# EAGLE schematic mainSch (EAGLE 8.2.2)
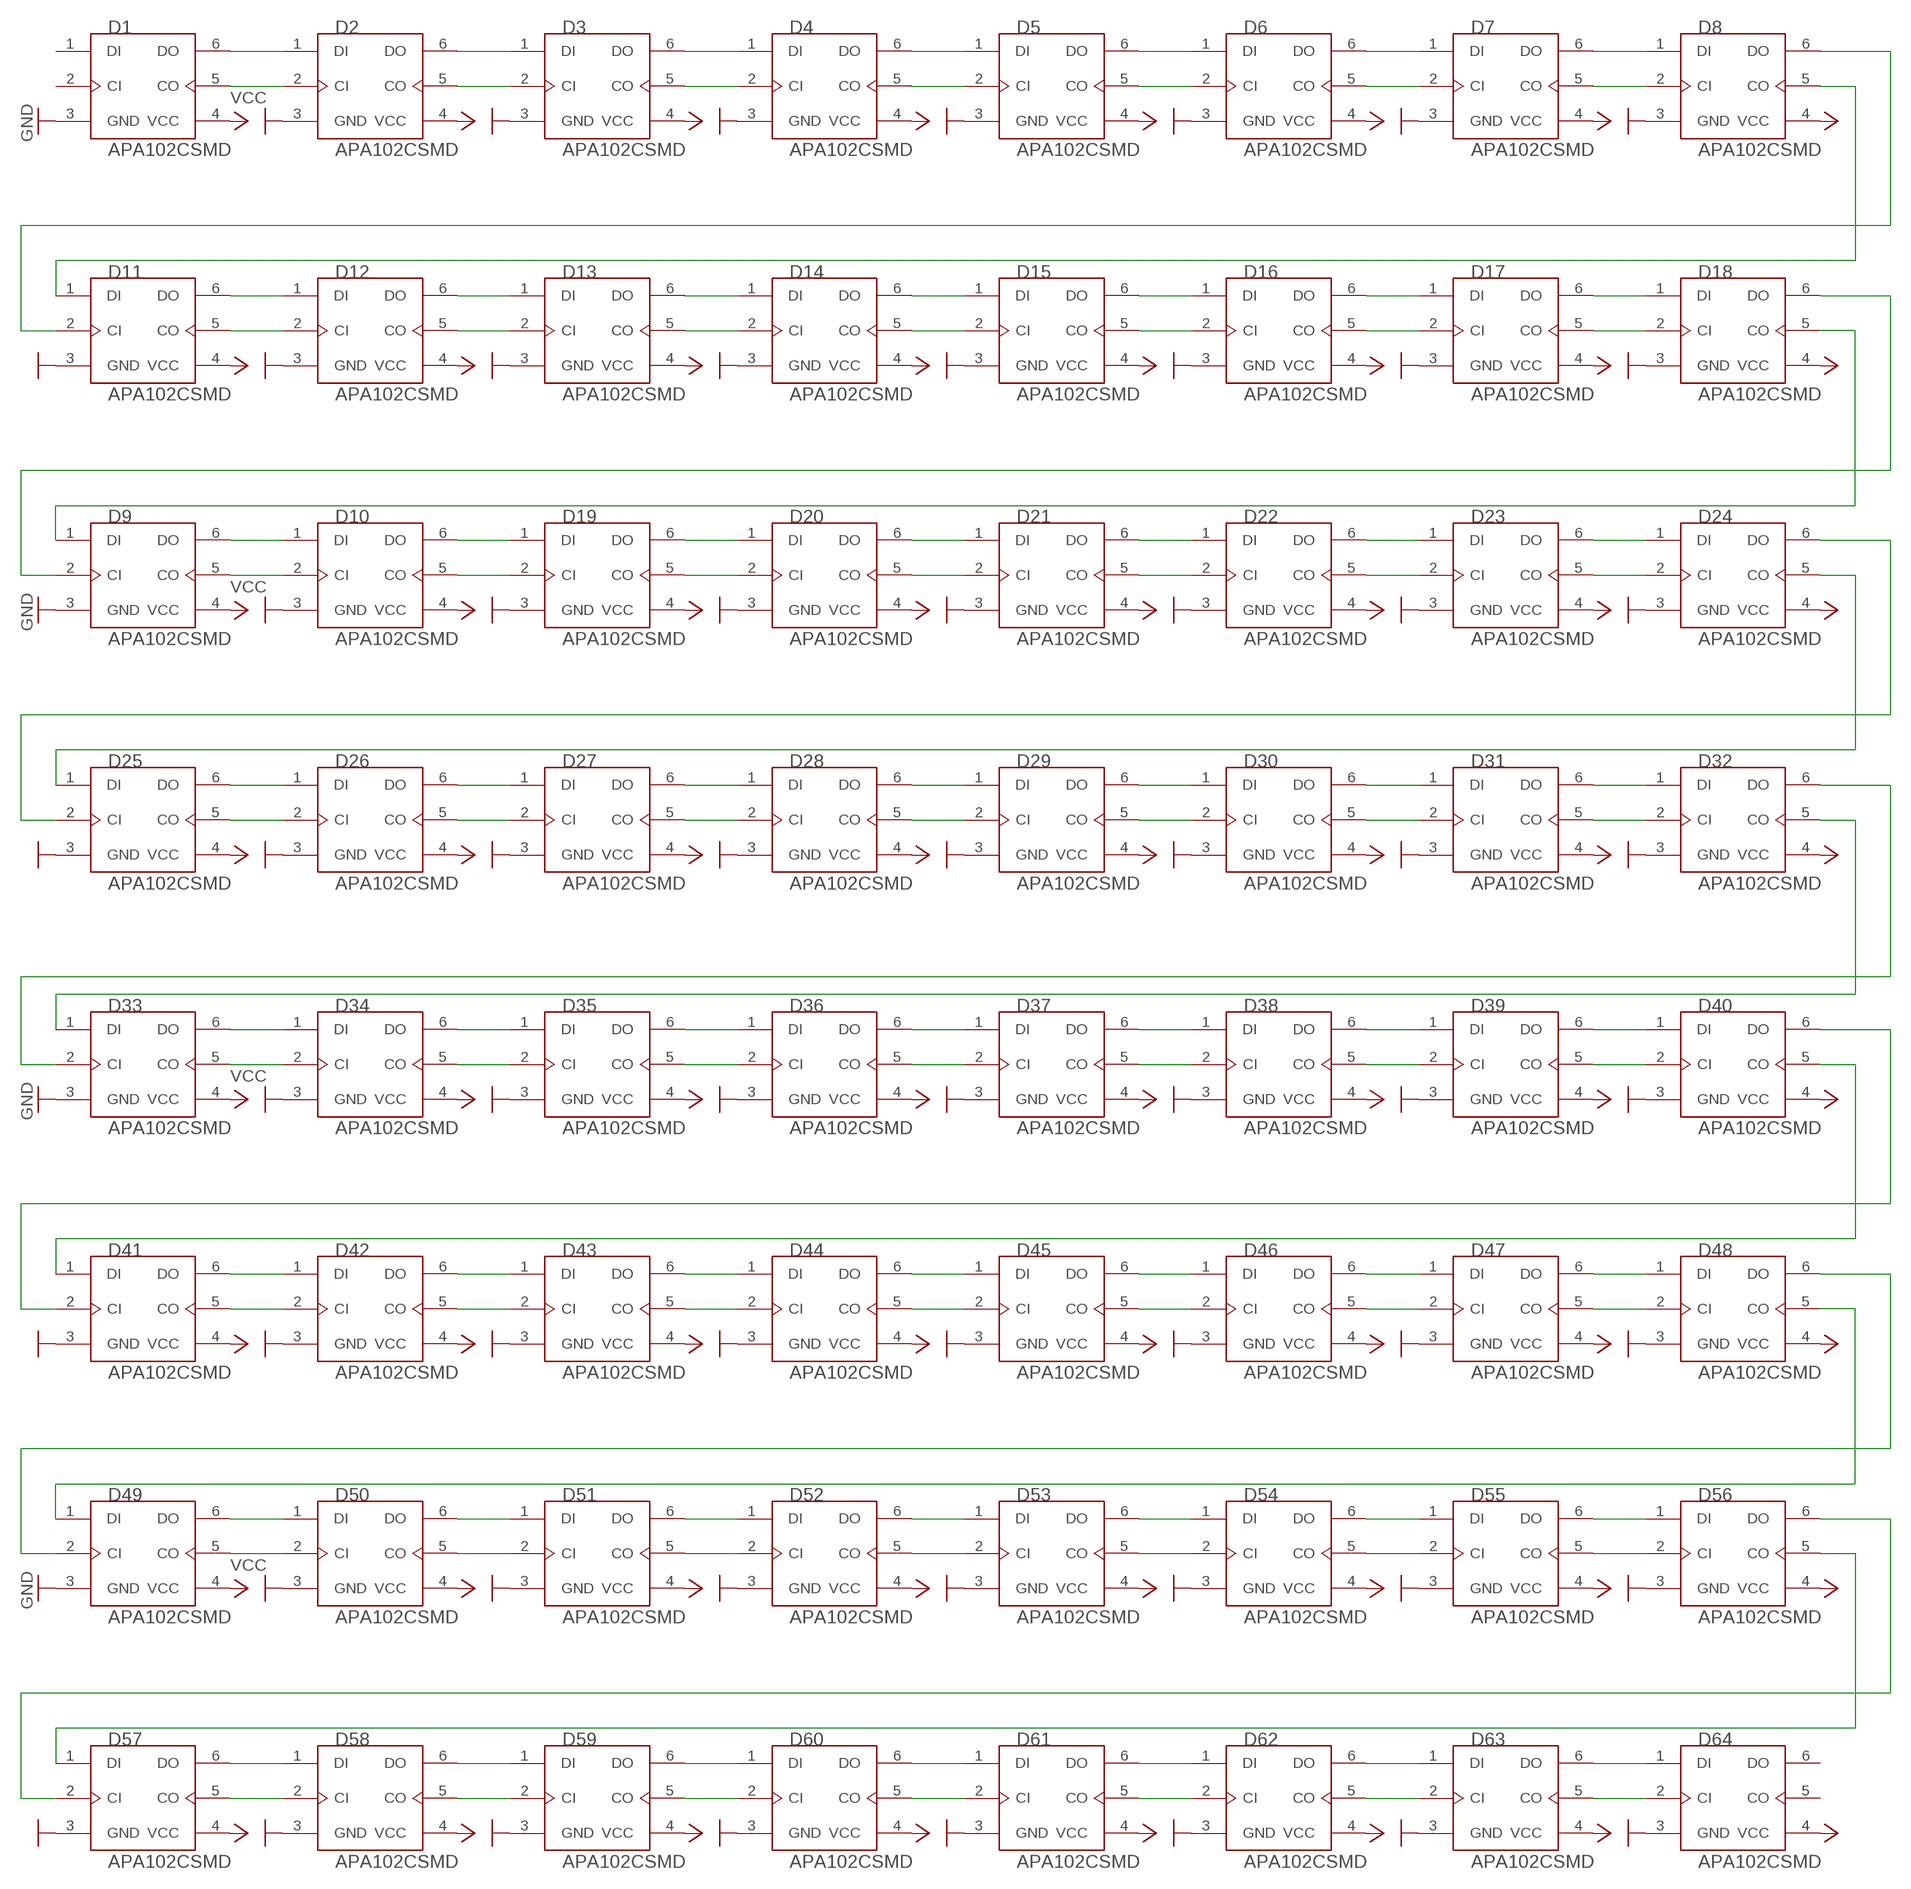
[diagram p0: schematic, sheet 1]

## Parts
D1  APA102CSMD  [APA102C-5050-SMD]
D2  APA102CSMD  [APA102C-5050-SMD]
D3  APA102CSMD  [APA102C-5050-SMD]
D4  APA102CSMD  [APA102C-5050-SMD]
D5  APA102CSMD  [APA102C-5050-SMD]
D6  APA102CSMD  [APA102C-5050-SMD]
D7  APA102CSMD  [APA102C-5050-SMD]
D8  APA102CSMD  [APA102C-5050-SMD]
D9  APA102CSMD  [APA102C-5050-SMD]
D10  APA102CSMD  [APA102C-5050-SMD]
D11  APA102CSMD  [APA102C-5050-SMD]
D12  APA102CSMD  [APA102C-5050-SMD]
D13  APA102CSMD  [APA102C-5050-SMD]
D14  APA102CSMD  [APA102C-5050-SMD]
D15  APA102CSMD  [APA102C-5050-SMD]
D16  APA102CSMD  [APA102C-5050-SMD]
D17  APA102CSMD  [APA102C-5050-SMD]
D18  APA102CSMD  [APA102C-5050-SMD]
D19  APA102CSMD  [APA102C-5050-SMD]
D20  APA102CSMD  [APA102C-5050-SMD]
D21  APA102CSMD  [APA102C-5050-SMD]
D22  APA102CSMD  [APA102C-5050-SMD]
D23  APA102CSMD  [APA102C-5050-SMD]
D24  APA102CSMD  [APA102C-5050-SMD]
D25  APA102CSMD  [APA102C-5050-SMD]
D26  APA102CSMD  [APA102C-5050-SMD]
D27  APA102CSMD  [APA102C-5050-SMD]
D28  APA102CSMD  [APA102C-5050-SMD]
D29  APA102CSMD  [APA102C-5050-SMD]
D30  APA102CSMD  [APA102C-5050-SMD]
D31  APA102CSMD  [APA102C-5050-SMD]
D32  APA102CSMD  [APA102C-5050-SMD]
D33  APA102CSMD  [APA102C-5050-SMD]
D34  APA102CSMD  [APA102C-5050-SMD]
D35  APA102CSMD  [APA102C-5050-SMD]
D36  APA102CSMD  [APA102C-5050-SMD]
D37  APA102CSMD  [APA102C-5050-SMD]
D38  APA102CSMD  [APA102C-5050-SMD]
D39  APA102CSMD  [APA102C-5050-SMD]
D40  APA102CSMD  [APA102C-5050-SMD]
D41  APA102CSMD  [APA102C-5050-SMD]
D42  APA102CSMD  [APA102C-5050-SMD]
D43  APA102CSMD  [APA102C-5050-SMD]
D44  APA102CSMD  [APA102C-5050-SMD]
D45  APA102CSMD  [APA102C-5050-SMD]
D46  APA102CSMD  [APA102C-5050-SMD]
D47  APA102CSMD  [APA102C-5050-SMD]
D48  APA102CSMD  [APA102C-5050-SMD]
D49  APA102CSMD  [APA102C-5050-SMD]
D50  APA102CSMD  [APA102C-5050-SMD]
D51  APA102CSMD  [APA102C-5050-SMD]
D52  APA102CSMD  [APA102C-5050-SMD]
D53  APA102CSMD  [APA102C-5050-SMD]
D54  APA102CSMD  [APA102C-5050-SMD]
D55  APA102CSMD  [APA102C-5050-SMD]
D56  APA102CSMD  [APA102C-5050-SMD]
D57  APA102CSMD  [APA102C-5050-SMD]
D58  APA102CSMD  [APA102C-5050-SMD]
D59  APA102CSMD  [APA102C-5050-SMD]
D60  APA102CSMD  [APA102C-5050-SMD]
D61  APA102CSMD  [APA102C-5050-SMD]
D62  APA102CSMD  [APA102C-5050-SMD]
D63  APA102CSMD  [APA102C-5050-SMD]
D64  APA102CSMD  [APA102C-5050-SMD]

## Nets
GND: D1.3(GND) D2.3(GND) D3.3(GND) D9.3(GND) D10.3(GND) D19.3(GND) D20.3(GND) D21.3(GND) D22.3(GND) D23.3(GND) D24.3(GND) D25.3(GND) D26.3(GND) D27.3(GND) D28.3(GND) D29.3(GND) D30.3(GND) D31.3(GND) D32.3(GND) D33.3(GND) D34.3(GND) D35.3(GND) D36.3(GND) D37.3(GND) D38.3(GND) D39.3(GND) D40.3(GND) D41.3(GND) D42.3(GND) D43.3(GND) D44.3(GND) D45.3(GND) D46.3(GND) D47.3(GND) D48.3(GND) D49.3(GND) D50.3(GND) D51.3(GND) D52.3(GND) D53.3(GND) D54.3(GND) D55.3(GND) D56.3(GND) D57.3(GND) D58.3(GND) D59.3(GND) D60.3(GND) D61.3(GND) D62.3(GND) D63.3(GND) D64.3(GND)
N$1: D1.6(DO) D2.1(DI)
N$2: D1.5(CO) D2.2(CI)
N$3: D2.6(DO) D3.1(DI)
N$4: D2.5(CO) D3.2(CI)
N$5: D3.5(CO) D4.2(CI)
N$6: D4.5(CO) D5.2(CI)
N$7: D5.5(CO) D6.2(CI)
N$8: D5.6(DO) D6.1(DI)
N$9: D4.6(DO) D5.1(DI)
N$10: D3.6(DO) D4.1(DI)
N$11: D6.6(DO) D7.1(DI)
N$12: D7.6(DO) D8.1(DI)
N$13: D8.5(CO) D11.1(DI)
N$14: D8.6(DO) D11.2(CI)
N$15: D9.6(DO) D10.1(DI)
N$16: D9.5(CO) D10.2(CI)
N$17: D11.5(CO) D12.2(CI)
N$18: D11.6(DO) D12.1(DI)
N$19: D12.6(DO) D13.1(DI)
N$20: D12.5(CO) D13.2(CI)
N$21: D13.6(DO) D14.1(DI)
N$22: D13.5(CO) D14.2(CI)
N$23: D14.6(DO) D15.1(DI)
N$24: D14.5(CO) D15.2(CI)
N$25: D15.5(CO) D16.2(CI)
N$26: D15.6(DO) D16.1(DI)
N$27: D16.5(CO) D17.2(CI)
N$28: D16.6(DO) D17.1(DI)
N$29: D17.5(CO) D18.2(CI)
N$30: D17.6(DO) D18.1(DI)
N$31: D10.6(DO) D19.1(DI)
N$32: D10.5(CO) D19.2(CI)
N$33: D19.5(CO) D20.2(CI)
N$34: D20.5(CO) D21.2(CI)
N$35: D6.5(CO) D7.2(CI)
N$36: D7.5(CO) D8.2(CI)
N$37: D21.5(CO) D22.2(CI)
N$38: D21.6(DO) D22.1(DI)
N$39: D20.6(DO) D21.1(DI)
N$40: D19.6(DO) D20.1(DI)
N$41: D22.6(DO) D23.1(DI)
N$42: D23.6(DO) D24.1(DI)
N$43: D25.5(CO) D26.2(CI)
N$44: D25.6(DO) D26.1(DI)
N$45: D26.6(DO) D27.1(DI)
N$46: D26.5(CO) D27.2(CI)
N$47: D27.6(DO) D28.1(DI)
N$48: D27.5(CO) D28.2(CI)
N$49: D28.6(DO) D29.1(DI)
N$50: D28.5(CO) D29.2(CI)
N$51: D29.5(CO) D30.2(CI)
N$52: D29.6(DO) D30.1(DI)
N$53: D30.5(CO) D31.2(CI)
N$54: D30.6(DO) D31.1(DI)
N$55: D31.5(CO) D32.2(CI)
N$56: D31.6(DO) D32.1(DI)
N$57: D22.5(CO) D23.2(CI)
N$58: D23.5(CO) D24.2(CI)
N$59: D24.5(CO) D25.1(DI)
N$60: D24.6(DO) D25.2(CI)
N$61: D9.2(CI) D18.6(DO)
N$62: D9.1(DI) D18.5(CO)
N$63: D33.6(DO) D34.1(DI)
N$64: D33.5(CO) D34.2(CI)
N$65: D34.6(DO) D35.1(DI)
N$66: D34.5(CO) D35.2(CI)
N$67: D35.5(CO) D36.2(CI)
N$68: D36.5(CO) D37.2(CI)
N$69: D37.5(CO) D38.2(CI)
N$70: D37.6(DO) D38.1(DI)
N$71: D36.6(DO) D37.1(DI)
N$72: D35.6(DO) D36.1(DI)
N$73: D38.6(DO) D39.1(DI)
N$74: D39.6(DO) D40.1(DI)
N$75: D41.5(CO) D42.2(CI)
N$76: D41.6(DO) D42.1(DI)
N$77: D42.6(DO) D43.1(DI)
N$78: D42.5(CO) D43.2(CI)
N$79: D43.6(DO) D44.1(DI)
N$80: D43.5(CO) D44.2(CI)
N$81: D44.6(DO) D45.1(DI)
N$82: D44.5(CO) D45.2(CI)
N$83: D45.5(CO) D46.2(CI)
N$84: D45.6(DO) D46.1(DI)
N$85: D46.5(CO) D47.2(CI)
N$86: D46.6(DO) D47.1(DI)
N$87: D47.5(CO) D48.2(CI)
N$88: D47.6(DO) D48.1(DI)
N$89: D38.5(CO) D39.2(CI)
N$90: D39.5(CO) D40.2(CI)
N$91: D40.5(CO) D41.1(DI)
N$92: D40.6(DO) D41.2(CI)
N$93: D49.6(DO) D50.1(DI)
N$94: D49.5(CO) D50.2(CI)
N$95: D50.6(DO) D51.1(DI)
N$96: D50.5(CO) D51.2(CI)
N$97: D51.5(CO) D52.2(CI)
N$98: D52.5(CO) D53.2(CI)
N$99: D53.5(CO) D54.2(CI)
N$100: D53.6(DO) D54.1(DI)
N$101: D52.6(DO) D53.1(DI)
N$102: D51.6(DO) D52.1(DI)
N$103: D54.6(DO) D55.1(DI)
N$104: D55.6(DO) D56.1(DI)
N$105: D57.5(CO) D58.2(CI)
N$106: D57.6(DO) D58.1(DI)
N$107: D58.6(DO) D59.1(DI)
N$108: D58.5(CO) D59.2(CI)
N$109: D59.6(DO) D60.1(DI)
N$110: D59.5(CO) D60.2(CI)
N$111: D60.6(DO) D61.1(DI)
N$112: D60.5(CO) D61.2(CI)
N$113: D61.5(CO) D62.2(CI)
N$114: D61.6(DO) D62.1(DI)
N$115: D62.5(CO) D63.2(CI)
N$116: D62.6(DO) D63.1(DI)
N$117: D63.5(CO) D64.2(CI)
N$118: D63.6(DO) D64.1(DI)
N$119: D54.5(CO) D55.2(CI)
N$120: D55.5(CO) D56.2(CI)
N$121: D56.5(CO) D57.1(DI)
N$122: D56.6(DO) D57.2(CI)
N$123: D48.6(DO) D49.2(CI)
N$124: D48.5(CO) D49.1(DI)
N$125: D32.5(CO) D33.1(DI)
N$126: D32.6(DO) D33.2(CI)
VCC: D1.4(VCC) D9.4(VCC) D10.4(VCC) D11.4(VCC) D19.4(VCC) D20.4(VCC) D21.4(VCC) D22.4(VCC) D23.4(VCC) D24.4(VCC) D25.4(VCC) D26.4(VCC) D27.4(VCC) D28.4(VCC) D29.4(VCC) D30.4(VCC) D31.4(VCC) D32.4(VCC) D33.4(VCC) D34.4(VCC) D35.4(VCC) D36.4(VCC) D37.4(VCC) D38.4(VCC) D39.4(VCC) D40.4(VCC) D41.4(VCC) D42.4(VCC) D43.4(VCC) D44.4(VCC) D45.4(VCC) D46.4(VCC) D47.4(VCC) D48.4(VCC) D49.4(VCC) D50.4(VCC) D51.4(VCC) D52.4(VCC) D53.4(VCC) D54.4(VCC) D55.4(VCC) D56.4(VCC) D57.4(VCC) D58.4(VCC) D59.4(VCC) D60.4(VCC) D61.4(VCC) D62.4(VCC) D63.4(VCC) D64.4(VCC)
Unconnected: D1.1(DI) D1.2(CI) D64.5(CO) D64.6(DO)

## Power pins joined to a net without a drawn wire
GND: D4.3(GND) D5.3(GND) D6.3(GND) D7.3(GND) D8.3(GND) D11.3(GND) D12.3(GND) D13.3(GND) D14.3(GND) D15.3(GND) D16.3(GND) D17.3(GND) D18.3(GND)
VCC: D2.4(VCC) D3.4(VCC) D4.4(VCC) D5.4(VCC) D6.4(VCC) D7.4(VCC) D8.4(VCC) D12.4(VCC) D13.4(VCC) D14.4(VCC) D15.4(VCC) D16.4(VCC) D17.4(VCC) D18.4(VCC)

## Library data of the parts
D1-D64 = parts:APA102C: APA102C 5050 rgb LED using the SPI interface. Supporting Materials: APA102c Datasheet <https://cdn-shop.adafruit.com/datasheets/APA102.pdf>